# Altium schematic sheet Storage Memory.SchDoc
size A; SheetNumber: 6; SheetTotal: 6
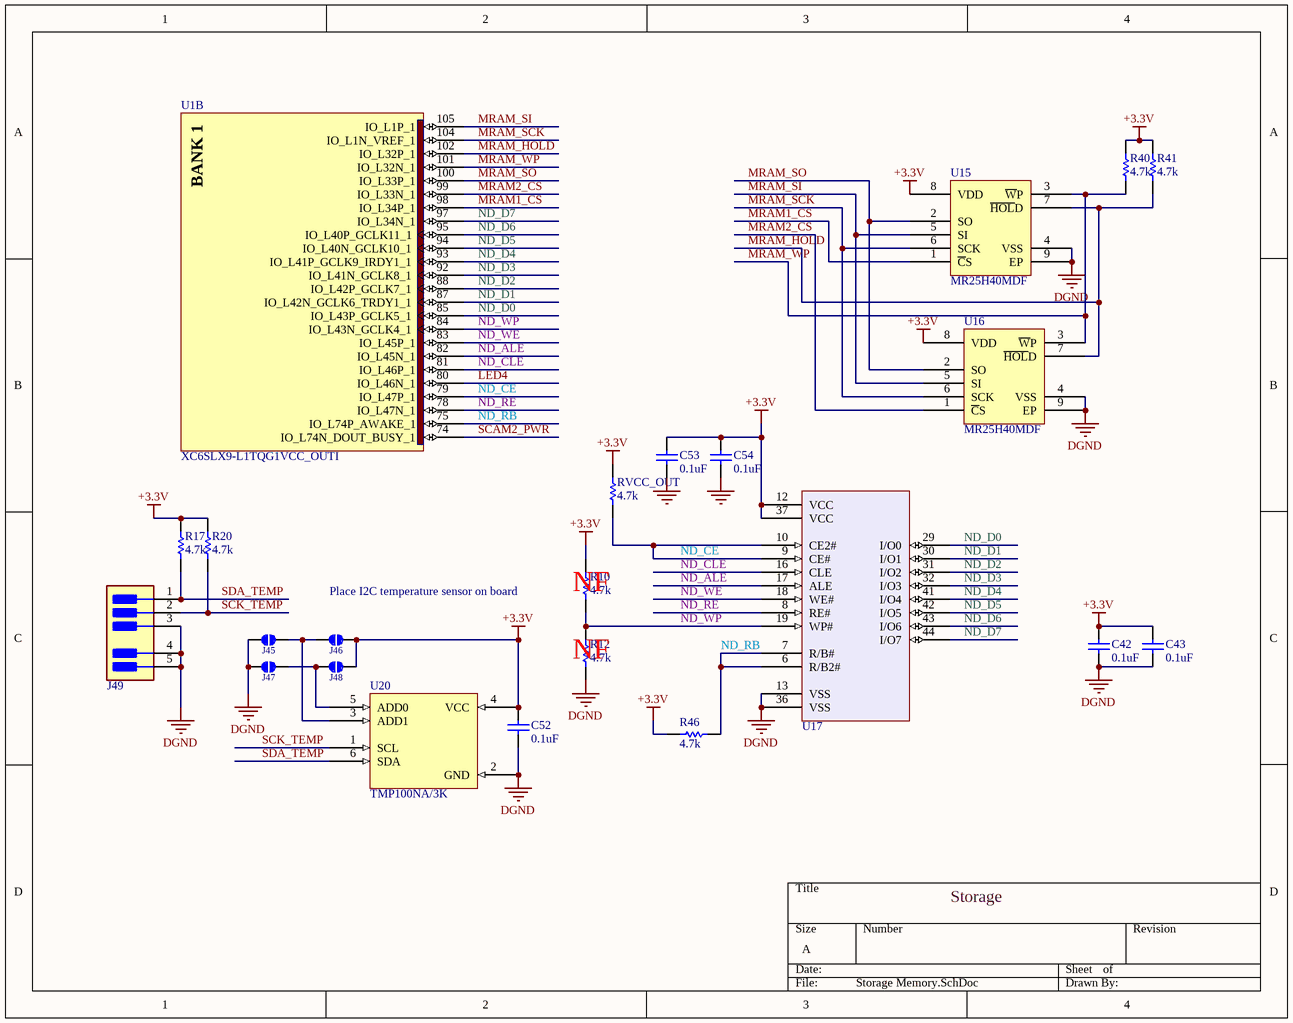
[diagram p0: Storage Memory.SchDoc]

## Parts
C42  0.1uF  [0805CAP]
C43  0.1uF  [0805CAP]
C52  0.1uF  [0805CAP]
C53  value 0.1uF  [0805 - CAP]  (hidden comment: Cap_CER_0.1U_16V_0805)
C54  value 0.1uF  [0805 - CAP]  (hidden comment: Cap_CER_0.1U_16V_0805)
J45  JUMPER  [SJMP]  (value not drawn)
J46  JUMPER  [SJMP]  (value not drawn)
J47  JUMPER  [SJMP]  (value not drawn)
J48  JUMPER  [SJMP]  (value not drawn)
J49  53261-0371  [FP-53261-0371-MFG]  (value not drawn)
R10  Resistance (Ohms): 4.7k  [0603RES]  (hidden comment: RES_4.7K_0.1W_0603)
R12  Resistance (Ohms): 4.7k  [0603RES]  (hidden comment: RES_4.7K_0.1W_0603)
R17  Resistance (Ohms): 4.7k  [0603RES]  (hidden comment: RES_4.7K_0.1W_0603)
R20  Resistance (Ohms): 4.7k  [0603RES]  (hidden comment: RES_4.7K_0.1W_0603)
R40  Resistance (Ohms): 4.7k  [0603RES]  (hidden comment: RES_4.7K_0.1W_0603)
R41  Resistance (Ohms): 4.7k  [0603RES]  (hidden comment: RES_4.7K_0.1W_0603)
R46  Resistance (Ohms): 4.7k  [0603RES]  (hidden comment: RES_4.7K_0.1W_0603)
RVCC_OUT  Resistance (Ohms): 4.7k  [0603RES]  (hidden comment: RES_4.7K_0.1W_0603)
U1  XC6SLX9-L1TQG1VCC_OUTI  [TQG144_M]  (part B of 7)
U15  MR25H40MDF  [DFN8]
U16  MR25H40MDF  [DFN8]
U17  MT29F8G08AB  [VOG48]  (value not drawn)
U20  TMP100NA/3K  [SOT-23-6]

## Nets
+3.3V: C42.2 C43.2 C52.2 C53.2 C54.2 J46.1 J48.1 R10.2 R17.2 R20.2 R40.1 R41.1 R46.1 RVCC_OUT.2 U15.8(VDD) U16.8(VDD) U17.12(VCC) U17.37(VCC) U20.4(VCC)
DGND: C42.1 C43.1 C52.1 C53.1 C54.1 J45.2 J47.2 J49.3 J49.4 J49.5 R12.1 U15.4(VSS) U15.9(EP) U16.4(VSS) U16.9(EP) U17.13(VSS) U17.36(VSS) U20.2(GND)
LED4: U1.80(IO_L46N_1)
MRAM1_CS: U1.98(IO_L34P_1) U15.1(~{C}S)
MRAM2_CS: U1.99(IO_L33N_1) U16.1(~{C}S)
MRAM_HOLD: R41.2 U1.102(IO_L32P_1) U15.7(~{HOL}D) U16.7(~{HOL}D)
MRAM_SCK: U1.104(IO_L1N_VREF_1) U15.6(SCK) U16.6(SCK)
MRAM_SI: U1.105(IO_L1P_1) U15.5(SI) U16.5(SI)
MRAM_SO: U1.100(IO_L33P_1) U15.2(SO) U16.2(SO)
MRAM_WP: R40.2 U1.101(IO_L32N_1) U15.3(~{W}P) U16.3(~{W}P)
ND_ALE: U1.82(IO_L45N_1) U17.17(ALE)
ND_CE: RVCC_OUT.1 U1.79(IO_L47P_1) U17.9(CE#) U17.10(CE2#)
ND_CLE: U1.81(IO_L46P_1) U17.16(CLE)
ND_D0: U1.85(IO_L43P_GCLK5_1) U17.29(I/O0)
ND_D1: U1.87(IO_L42N_GCLK6_TRDY1_1) U17.30(I/O1)
ND_D2: U1.88(IO_L42P_GCLK7_1) U17.31(I/O2)
ND_D3: U1.92(IO_L41N_GCLK8_1) U17.32(I/O3)
ND_D4: U1.93(IO_L41P_GCLK9_IRDY1_1) U17.41(I/O4)
ND_D5: U1.94(IO_L40N_GCLK10_1) U17.42(I/O5)
ND_D6: U1.95(IO_L40P_GCLK11_1) U17.43(I/O6)
ND_D7: U1.97(IO_L34N_1) U17.44(I/O7)
ND_RB: R46.2 U1.75(IO_L74P_AWAKE_1) U17.6(R/B2#) U17.7(R/B#)
ND_RE: U1.78(IO_L47N_1) U17.8(RE#)
ND_WE: U1.83(IO_L45P_1) U17.18(WE#)
ND_WP: R10.1 R12.2 U1.84(IO_L43N_GCLK4_1) U17.19(WP#)
SCAM2_PWR: U1.74(IO_L74N_DOUT_BUSY_1)
SCK_TEMP: J49.2 R20.1 U20.1(SCL)
SDA_TEMP: J49.1 R17.1 U20.6(SDA)
NetJ45_1: J45.1 J46.2 U20.3(ADD1)
NetJ47_1: J47.1 J48.2 U20.5(ADD0)

## Notes on the sheet
- Place I2C temperature sensor on board
- (near R10) NF
- (near R12) NF
- Storage
- (in symbol XC6SLX9-L1TQG144I, part B) BANK 1

## Library data of the parts
C42 C43 C52 = CAP_CER_0.1uf_10V_0805: Surface Mount Ceramic Multilayer Capacitor 0.1uF 10% X7R 16V 0805 Paper T/R; Manufacturer: Yageo; Manufacturer Part Number: CC0805KRX7R7BB104; Capacitance: 100nF; Insulation Resistance: 100GR; Supplier 1: Digi-Key; RoHS: Yes; Category: Ceramic Capacitors; Pricing 1: 1=0.12000, 10=0.08400, 50=0.04760, 100=0.03950, 500=0.02768, 1000=0.02291 (USD); Mount: Surface Mount; Case/Package: 0805; Number of Pins: 2; Case Code (Metric): 2012; Case Code (Imperial): 0805; Min Operating Temperature: -55°C; Max Operating Temperature: 125°C; Tolerance: 10%; Voltage Rating: 16V; Voltage Rating (DC): 16V; Packaging: Tape and Reel; Package Quantity: 1; Dielectric: X7R; Termination: SMD/SMT; Resistor Type: Ceramic; Voltage: 16V; Series: CC; Length: 2mm; Width: 0.049inch; Height: 0.85mm; Thickness: 0.033inch; Depth: 1.25mm; Radiation Hardening: No; REACH SVHC: No SVHC; Lead Free: Lead Free; Halogen Free: Halogen Free; RoHS Compliant: Yes; ComponentLink1URL: https://datasheet.ciiva.com/8034/1784427-8034017.pdf?src-supplier=Element14; ComponentLink1Description: https://datasheet.ciiva.com/8034/1784427-8034017.pdf?src-supplier=Element14; ComponentLink2URL: https://datasheet.ciiva.com/11786/0900766b80d84f1d-11786102.pdf?src-supplier=RSComponents; ComponentLink2Description: https://datasheet.ciiva.com/11786/0900766b80d84f1d-11786102.pdf?src-supplier=RSComponents; ComponentLink3URL: https://datasheet.ciiva.com/7978/1489800-7978204.pdf?src-supplier=Element14; ComponentLink3Description: https://datasheet.ciiva.com/7978/1489800-7978204.pdf?src-supplier=Element14; ComponentLink4URL: https://datasheet.ciiva.com/144/mlccorderingcode-144999.pdf?src-supplier=Digi-Key; ComponentLink4Description: https://datasheet.ciiva.com/144/mlccorderingcode-144999.pdf?src-supplier=Digi-Key; ComponentLink5URL: https://datasheet.ciiva.com/144/mlccorderingcode-144998.pdf?src-supplier=Digi-Key; ComponentLink5Description: https://datasheet.ciiva.com/144/mlccorderingcode-144998.pdf?src-supplier=Digi-Key; ComponentLink6URL: https://datasheet.ciiva.com/145/mlccorderingcode-145000.pdf?src-supplier=Digi-Key; ComponentLink6Description: https://datasheet.ciiva.com/145/mlccorderingcode-145000.pdf?src-supplier=Digi-Key; ComponentLink7URL: https://datasheet.ciiva.com/8034/1784427-8034015.pdf?src-supplier=Element14; ComponentLink7Description: https://datasheet.ciiva.com/8034/1784427-8034015.pdf?src-supplier=Element14; ComponentLink8URL: https://datasheet.ciiva.com/11465/upy-gphc-x7r-6-3v-to-50v-8-11465289.pdf?src-supplier=Avnet; ComponentLink8Description: https://datasheet.ciiva.com/11465/upy-gphc-x7r-6-3v-to-50v-8-11465289.pdf?src-supplier=Avnet; ComponentLink9URL: https://datasheet.ciiva.com/15189/getdatasheetpartid-314877-15189221.pdf?src-supplier=Verical; ComponentLink9Description: https://datasheet.ciiva.com/15189/getdatasheetpartid-314877-15189221.pdf?src-supplier=Verical; Supplier Part Number 1: 311-1142-1-ND
C53 C54 = Cap_CER_0.1U_16V_0805: CAP CER 0.1UF 16V X7R 0805; Manufacturer: Samsung Electro-Mechanics America, Inc.; Manufacturer Part Number: CL21B104KOANNNC; Tolerance: ±10%; Capacitance: 0.10µF; Supplier 1: Digi-Key; RoHS: RoHS Compliant; Category: Capacitors; Stock 1: 126841; Pricing 1: 1=0.1, 10=0.033, 25=0.024, 50=0.018, 100=0.0147, 250=0.01232, 500=0.0105, 1000=0.00825 (USD); Packaging: Digi-Reel®; Part Status: Active; Voltage - Rated: 16V; Temperature Coefficient: X7R; Operating Temperature: -55°C ~ 125°C; Features: -; Ratings: -; Applications: General Purpose; Mounting Type: Surface Mount, MLCC; Package / Case: 0805 (2012 Metric); Size / Dimension: 0.079" L x 0.049" W (2.00mm x 1.25mm); Height - Seated (Max): -; Thickness (Max): 0.030" (0.75mm); Lead Spacing: -; Lead Style: -; ComponentLink1URL: http://www.samsungsem.com/kr/support/product-search/mlcc/__icsFiles/afieldfile/2016/08/18/S_CL21B104KOANNNC.pdf; ComponentLink1Description: http://www.samsungsem.com/kr/support/product-search/mlcc/__icsFiles/afieldfile/2016/08/18/S_CL21B104KOANNNC.pdf; Supplier Part Number 1: 1276-2448-6-ND
J45-J48 = JUMPER: OPTION SELECTION PAD; Supplier 1: Digi-Key
J49 = 0532610371: Conn Shrouded Header HDR 3 POS 1.25mm Solder RA SMD PicoBlade™ Embossed T/R; Manufacturer: Molex; ComponentLink2Description: Datasheet; ComponentLink2URL: https://www.molex.com/webdocs/datasheets/pdf/en-us/0532610371_PCB_HEADERS.pdf; Supplier 1: Digi-Key; Manufacturer Part Number: 53261-0371; RoHS: Yes; Category: Headers and Wire Housings; Stock 1: 30734; Pricing 1: 1=0.72000, 10=0.61000, 100=0.47430 (USD); Supplier Part Number 1: WM7621CT-ND
R10 R12 R17 R20 R40 R41 R46 RVCC_OUT = RES_4.7K_0.1W_0603: Resistor; Manufacturer: Stackpole Electronics Inc.; Manufacturer Part Number: RMCF0603JT4K70; Tolerance: ±5%; Power (Watts): 0.1W, 1/10W; Temperature Coefficient: ±200ppm/°C; Supplier 1: Digi-Key; RoHS: RoHS Compliant; Category: Resistors; Stock 1: 86000; Pricing 1: 1=0.1, 10=0.012, 25=0.0088, 50=0.0066, 100=0.0049, 250=0.00372, 500=0.00298, 1000=0.0022 (USD); Packaging: Cut Tape (CT); Part Status: Active; Composition: Thick Film; Features: Automotive AEC-Q200; Operating Temperature: -55°C ~ 155°C; Package / Case: 0603 (1608 Metric); Supplier Device Package: 0603; Size / Dimension: 0.061" L x 0.031" W (1.55mm x 0.80mm); Height - Seated (Max): 0.022" (0.55mm); Number of Terminations: 2; Failure Rate: -; ComponentLink1URL: https://www.seielect.com/Catalog/SEI-RMCF_RMCP.pdf; ComponentLink1Description: https://www.seielect.com/Catalog/SEI-RMCF_RMCP.pdf; Supplier Part Number 1: RMCF0603JT4K70CT-ND
U1 = XC6SLX9-L1TQG144I: Spartan-6 LX 1.0V FPGA, 102 User I/Os, 144-Pin TQFP (0.5mm Pitch), Low Power Version, Industrial Grade, Pb-Free; Published: 17-Nov-2009; DatasheetVersion: ver1.6, Nov-2010; PackageVersion: ver1.2, Jun-2004; PackageReference: TQG144; Publisher: Altium Limited; PackageDescription: 144-Pin Thin Quad Flat Pack (TQG144) - Pb-Free; Code_JEDEC: MS-026-BFB; ComponentLink1Description: Manufacturer Link; ComponentLink1URL: http://www.xilinx.com; ComponentLink2Description: Spartan-6 Datasheet; ComponentLink2URL: http://www.xilinx.com/support/documentation/data_sheets/ds160.pdf; ComponentLink3Description: Spartan-6 Documents; ComponentLink3URL: http://www.xilinx.com/support/documentation/spartan-6.htm; ComponentLink4Description: Xilinx.com Home; ComponentLink4URL: http://www.xilinx.com; Supplier 1: Digi-Key; Supplier Part Number 1: 122-1779-ND
U15 U16 = MR25H40MDF: IC MRAM 4MBIT 40MHZ 8DFN; Manufacturer: Everspin Technologies Inc.; Memory Type: Non-Volatile; Memory Format: RAM; Memory Size: 4Mb (512K x 8); Memory Interface: SPI; Voltage - Supply: 3 V ~ 3.6 V; Supplier 1: Digi-Key; Manufacturer Part Number: MR25H40MDF; RoHS: RoHS Compliant; Category: Integrated Circuits (ICs); Stock 1: 1016; Pricing 1: 1=17.53, 10=16.232, 25=16.0068, 50=15.8102, 100=13.856, 250=13.257, 500=13.16862 (USD); Packaging: Tray; Part Status: Active; Technology: MRAM (Magnetoresistive RAM); Write Cycle Time - Word, Page: -; Operating Temperature: -40°C ~ 125°C (TA); Mounting Type: Surface Mount; Package / Case: 8-VDFN Exposed Pad; Supplier Device Package: 8-DFN-EP, Small Flag (5x6); ComponentLink1URL: https://www.everspin.com/file/156640/download; ComponentLink1Description: https://www.everspin.com/file/156640/download; Supplier Part Number 1: 819-1055-ND
U17 = MT29F32G08AFABAWP: 8Gb x8 NAND Flash Memory; CircuitryPartsPN: MICRON-MT29F8G08FACWP; ManufacturerPN: MT29F8G08FACWP; Manufacturer: Micron Technology Inc; CategoryI: Integrated Circuits (ICs); SchematicRev: A; DesignedBy: Circuitry Parts; MfgURL: http://www.micron.com/; PackageName: TSOPI48; FootprintName: *; CategoryII: NAND FLASH MEMORY; Value: *; DesignedOn: 7/18/2005 3:01:38 PM
U20 = Temp_Sensor_I2C: SENSOR TEMP I2C/SMBUS SOT23-6; Manufacturer: Texas Instruments; Interface: I2C,SMBus,2-Wire; Max Supply Voltage: 5.5V; Min Supply Voltage: 2.7V; Output Current: 4mA; Nominal Supply Current: 150uA; Resolution: 12b; Operating Supply Current: 75uA; Quiescent Current: 45uA; Number of Bits: 12; Output Type: I2C,Digital; Supplier 1: Digi-Key; RoHS: Yes; Category: Integrated Circuits (ICs); Stock 1: 2604; Pricing 1: 1=2.67000, 5=2.53000, 10=2.16900, 25=1.73520, 50=1.59040, 100=1.44590, 500=1.26516, 1000=1.12057 (USD); Mount: Surface Mount; Case/Package: SOT-23; Number of Pins: 6; Contact Plating: Gold; Min Operating Temperature: -55°C; Max Operating Temperature: 125°C; Package Quantity: 1; Packaging: Tape and Reel; Max Supply Voltage (DC): 5.5V; Min Supply Voltage (DC): 2.7V; Series: -; Supply Current: 150uA; Radiation Hardening: No; Lead Free: Lead Free; Reach SVHC Compliant: Yes; RoHS Compliant: Yes; ComponentLink1URL: https://datasheet.ciiva.com/15098/getdatasheetpartid-300076-15098434.pdf?src-supplier=Verical; ComponentLink1Description: https://datasheet.ciiva.com/15098/getdatasheetpartid-300076-15098434.pdf?src-supplier=Verical; ComponentLink2URL: https://datasheet.ciiva.com/41462/001014642-da-01-en-ic-temp-sensor-di-tmp100na-3k-sot-6-tid-41462493.pdf?src-supplier=Conrad; ComponentLink2Description: https://datasheet.ciiva.com/41462/001014642-da-01-en-ic-temp-sensor-di-tmp100na-3k-sot-6-tid-41462493.pdf?src-supplier=Conrad; ComponentLink3URL: https://datasheet.ciiva.com/5786/87915-5786666.pdf?src-supplier=Farnell; ComponentLink3Description: https://datasheet.ciiva.com/5786/87915-5786666.pdf?src-supplier=Farnell; ComponentLink4URL: https://datasheet.ciiva.com/1514/1772209-1514093.pdf?src-supplier=Element14; ComponentLink4Description: https://datasheet.ciiva.com/1514/1772209-1514093.pdf?src-supplier=Element14; ComponentLink5URL: https://datasheet.ciiva.com/46390/1882709-46390844.pdf?src-supplier=Element14; ComponentLink5Description: https://datasheet.ciiva.com/46390/1882709-46390844.pdf?src-supplier=Element14; ComponentLink6URL: https://datasheet.ciiva.com/2003/tmp100-2003004.pdf?src-supplier=Digi-Key; ComponentLink6Description: https://datasheet.ciiva.com/2003/tmp100-2003004.pdf?src-supplier=Digi-Key; ComponentLink7URL: https://datasheet.ciiva.com/2003/tmp100-2003003.pdf?src-supplier=Digi-Key; ComponentLink7Description: https://datasheet.ciiva.com/2003/tmp100-2003003.pdf?src-supplier=Digi-Key; ComponentLink8URL: https://datasheet.ciiva.com/2003/tmp100-2003005.pdf?src-supplier=Digi-Key; ComponentLink8Description: https://datasheet.ciiva.com/2003/tmp100-2003005.pdf?src-supplier=Digi-Key; ComponentLink9URL: https://datasheet.ciiva.com/3280/tmp101-3280141.pdf?src-supplier=Avnet; ComponentLink9Description: https://datasheet.ciiva.com/3280/tmp101-3280141.pdf?src-supplier=Avnet; Supplier Part Number 1: 296-26833-1-ND; Manufacturer Part Number: TMP100NA/3K